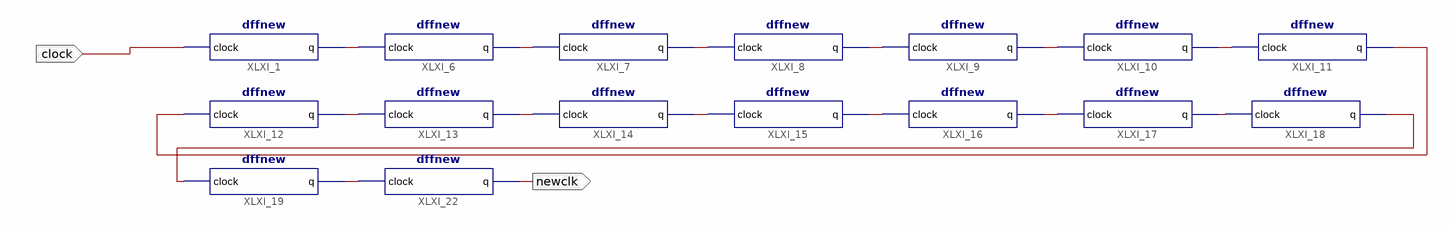
[diagram p0: schematic sheet 1]
// Xilinx ISE schematic freqdivide.sch (artix7) as structural Verilog: 16 symbols, 2 ports
module freqdivide (
  input  clock,
  output newclk
);

  wire XLXN_2, XLXN_3, XLXN_4, XLXN_5, XLXN_6, XLXN_7, XLXN_8, XLXN_9, XLXN_10, XLXN_11, XLXN_12, XLXN_13,
       XLXN_14, XLXN_15, XLXN_16;

  dffnew XLXI_1 (.clock(clock), .q(XLXN_2));
  dffnew XLXI_6 (.clock(XLXN_2), .q(XLXN_3));
  dffnew XLXI_7 (.clock(XLXN_3), .q(XLXN_4));
  dffnew XLXI_8 (.clock(XLXN_4), .q(XLXN_5));
  dffnew XLXI_9 (.clock(XLXN_5), .q(XLXN_6));
  dffnew XLXI_10 (.clock(XLXN_6), .q(XLXN_7));
  dffnew XLXI_11 (.clock(XLXN_7), .q(XLXN_14));
  dffnew XLXI_12 (.clock(XLXN_14), .q(XLXN_8));
  dffnew XLXI_13 (.clock(XLXN_8), .q(XLXN_9));
  dffnew XLXI_14 (.clock(XLXN_9), .q(XLXN_10));
  dffnew XLXI_15 (.clock(XLXN_10), .q(XLXN_11));
  dffnew XLXI_16 (.clock(XLXN_11), .q(XLXN_12));
  dffnew XLXI_17 (.clock(XLXN_12), .q(XLXN_16));
  dffnew XLXI_18 (.clock(XLXN_16), .q(XLXN_15));
  dffnew XLXI_19 (.clock(XLXN_15), .q(XLXN_13));
  dffnew XLXI_22 (.clock(XLXN_13), .q(newclk));
endmodule
